# EasyEDA Pro project Motor_Driver_T.eprj

# Schematic Schematic1
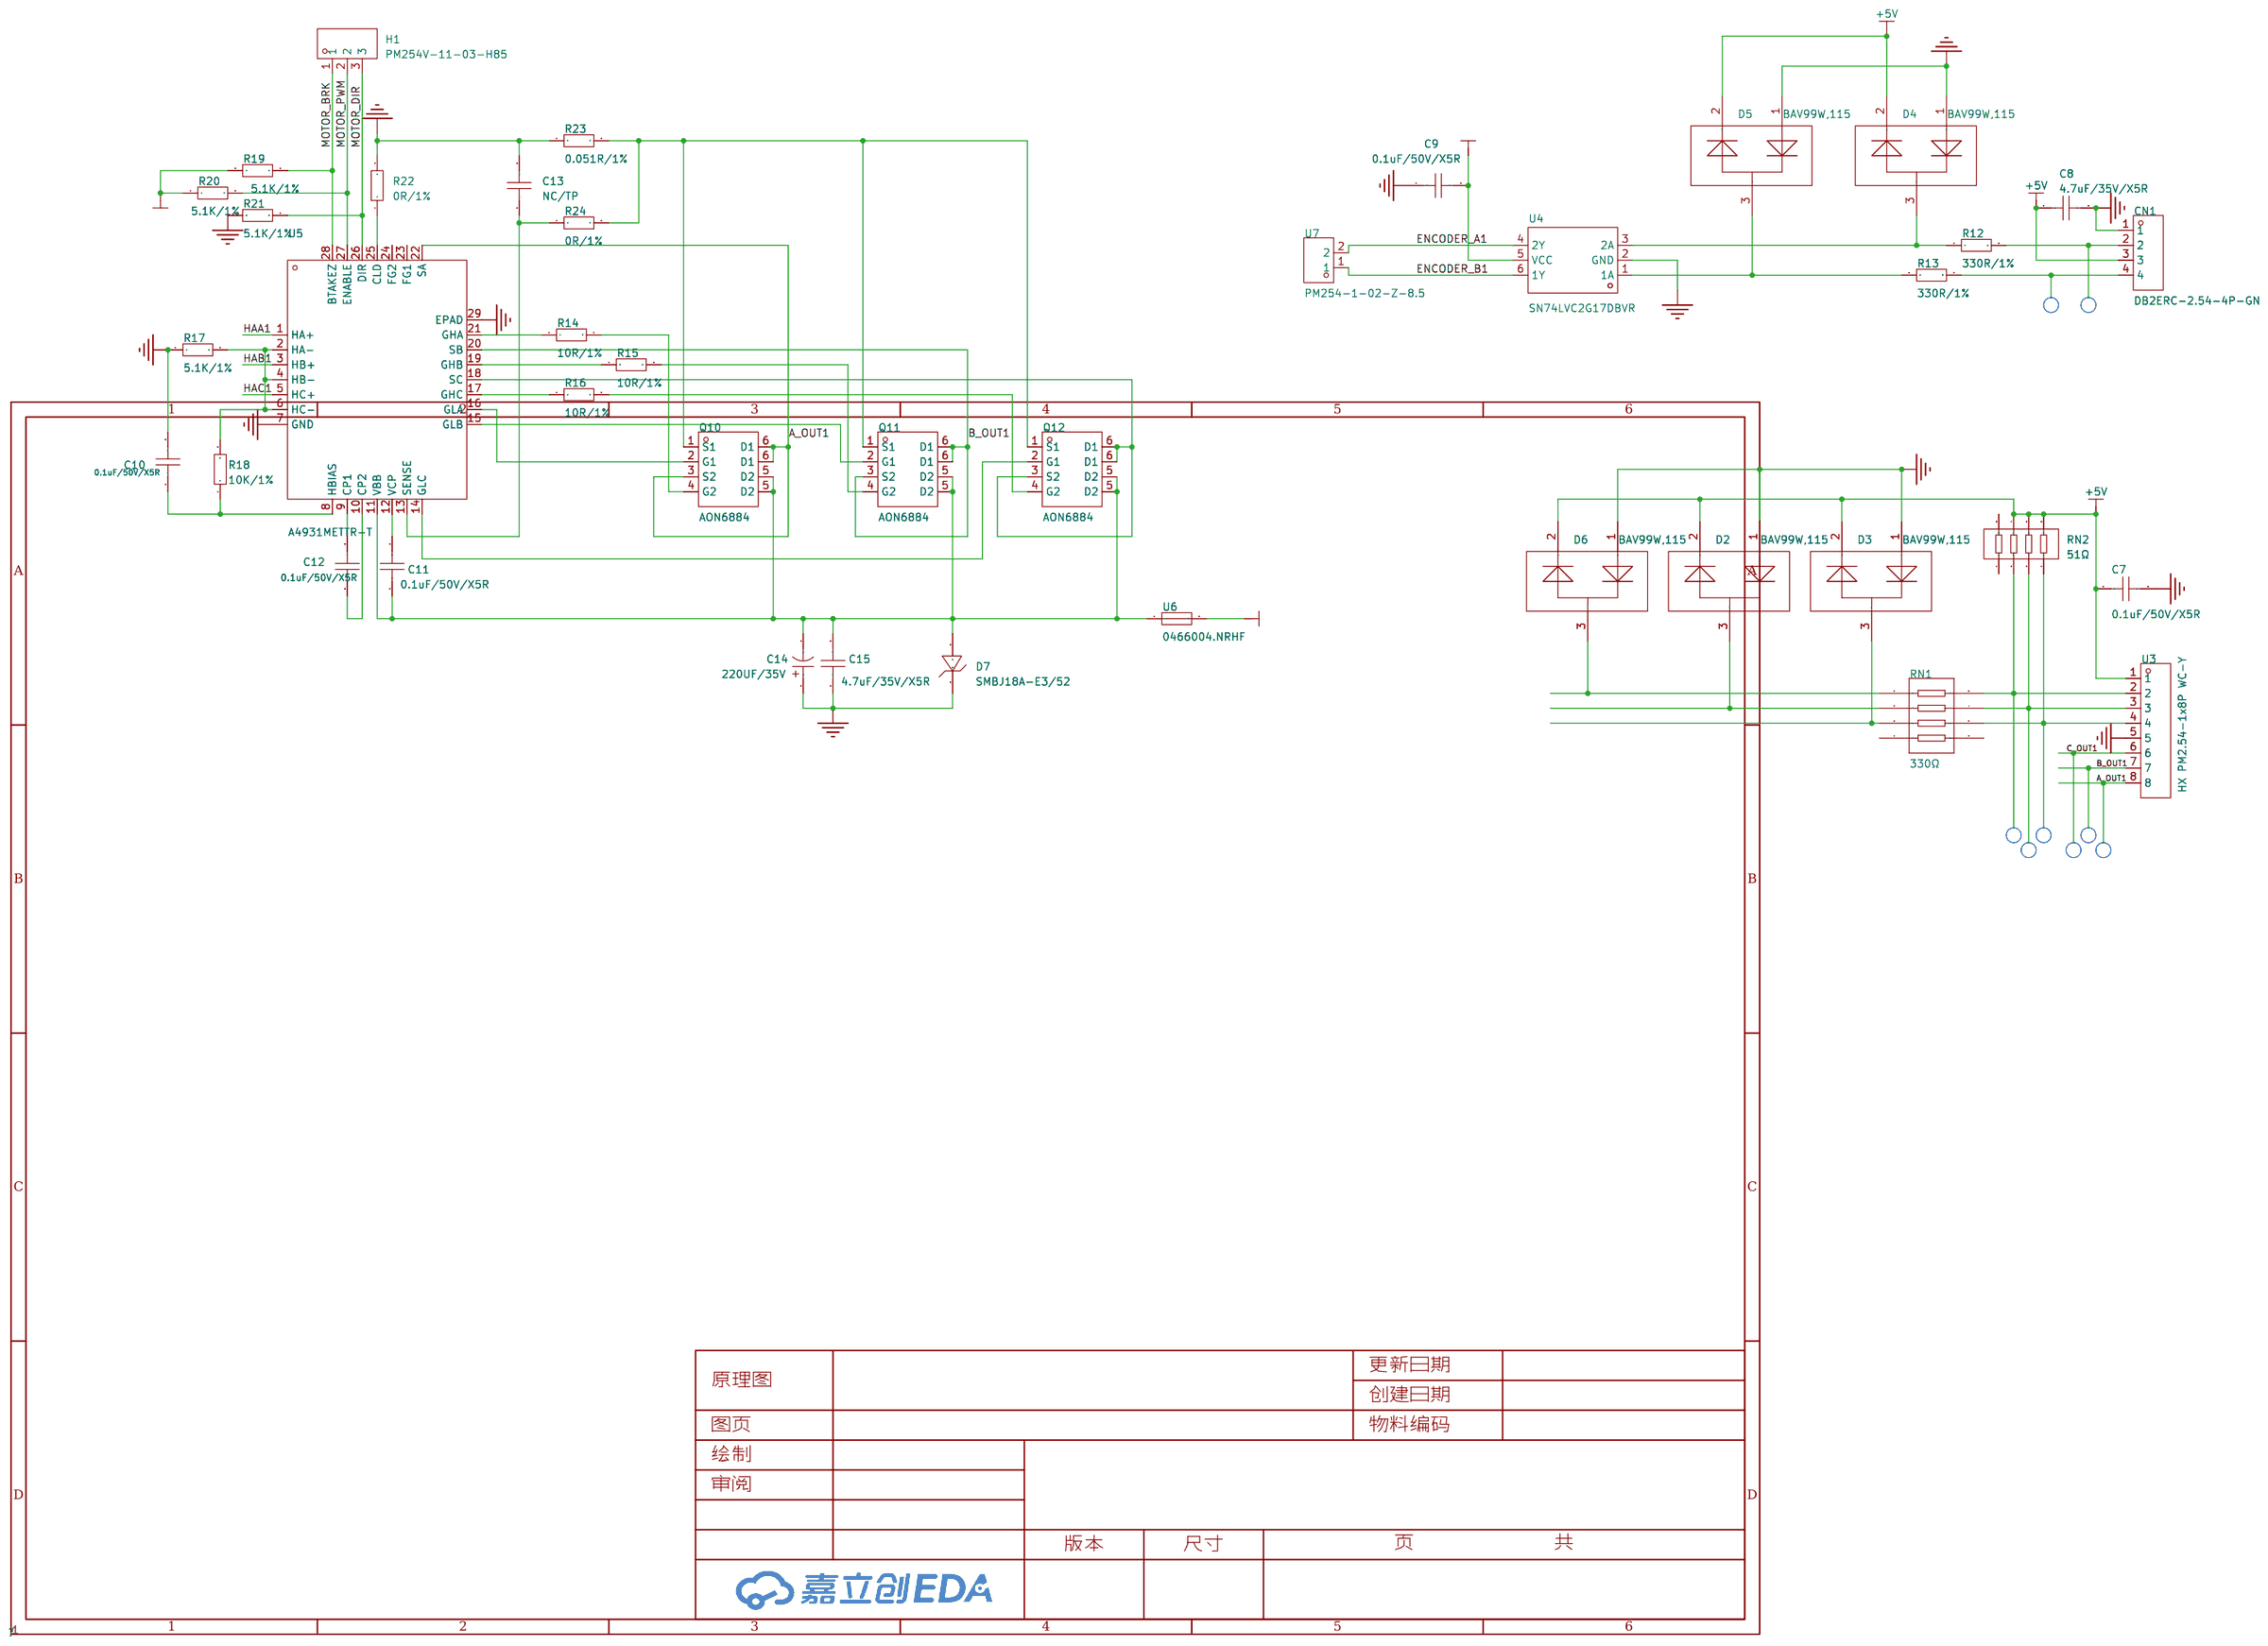
[diagram p0: schematic sheet]

## Parts
C7  100nF  [C0603]
C8  100nF  [C0603]
C9  100nF  [C0603]
C10  100nF  [C0603]
C11  100nF  [C0603]
C12  100nF  [C0603]
C13  100nF  [C0603]
C14  220uF  [CAP-SMD_BD8.0-L8.3-W8.3-LS9.3-FD]
C15  100nF  [C0603]
CN1  DB2ERC-2.54-4P-GN  [CONN-TH_4P-P2.54_DIBO_DB2ERC-2.54-4P-GN]
D2  BAV99W,115  [SOT-323_L2.0-W1.3-P1.30-LS2.1-BR]
D3  BAV99W,115  [SOT-323_L2.0-W1.3-P1.30-LS2.1-BR]
D4  BAV99W,115  [SOT-323_L2.0-W1.3-P1.30-LS2.1-BR]
D5  BAV99W,115  [SOT-323_L2.0-W1.3-P1.30-LS2.1-BR]
D6  BAV99W,115  [SOT-323_L2.0-W1.3-P1.30-LS2.1-BR]
D7  SMBJ18A-E3/52  [SMB_L4.6-W3.6-LS5.4-RD]
H1  PM254V-11-03-H85  [HDR-TH_3P-P2.54-V-F]
Q10  AON6884  [DFN-8_L5.5-W5.2-P1.27-LS6.0-BL-EP2]
Q11  AON6884  [DFN-8_L5.5-W5.2-P1.27-LS6.0-BL-EP2]
Q12  AON6884  [DFN-8_L5.5-W5.2-P1.27-LS6.0-BL-EP2]
R12  10K  [R0603]
R13  10K  [R0603]
R14  10K  [R0603]
R15  10K  [R0603]
R16  10K  [R0603]
R17  10K  [R0603]
R18  10K  [R0603]
R19  10K  [R0603]
R20  10K  [R0603]
R21  10K  [R0603]
R22  10K  [R0603]
R23  10K  [R0603]
R24  10K  [R0603]
RN1  330Ω  [RES-ARRAY-SMD_0603-8P-L3.2-W1.6-BL]
RN2  51Ω  [RES-ARRAY-SMD_8P-L3.2-W1.6-P0.80-BL-1]
U3  HX PM2.54-1x8P WC-Y  [HDR-TH_8P-P2.54-H-F-W10.3-N]
U4  SN74LVC2G17DBVR  [SOT-23-6_L2.9-W1.6-P0.95-LS2.8-BL]
U5  A4931METTR-T  [WQFN-28_L5.0-W5.0-P0.50-BL-EP3.2]
U6  0466004.NRHF  [F1206]
U7  PM254-1-02-Z-8.5  [HDR-TH_2P-P2.54-V-F]

## Library data of the parts
C7-C13 C15 = CAP_0603: Supplier Footprint: 0603
C14 = RVT220UF35V67RV0024: 容值:220uF;精度:±20%;额定电压:35V;纹波电流:195mA@120Hz;等效串联电阻:-;; LCSC Part Name: 220uF ±20% 35V; Supplier Part: C2836441; Manufacturer: KNSCHA(科尼盛); Supplier Footprint: SMD,D8xL10.2mm; JLCPCB Part Class: 扩展库; Datasheet: https://atta.szlcsc.com/upload/public/pdf/source/20210528/C2836441_17B1F737CDEB8BC64E6C288AF923F1CC.pdf; Supplier: LCSC; Tolerance: ±20%; Rated Voltage: 35V; Ripple Current: 195mA@120Hz; φD: 8mm; L: 10.2mm; Lifetime @ Temp: 2000hrs@105℃; Operating Temperature: -55℃~+105℃
CN1 = DB2ERC-2.54-4P-GN: 连接器类型:板端/插座-闭口;结构:1x4P;间距:2.54mm;颜色:绿色;安装方式:弯针;排数:1;每排PIN数:4;额定电流:5A;额定电压:150V;触头材质:铜合金;触头镀层:锡;工作温度范围:-40℃~+105℃;; LCSC Part Name: 2.54mm 1x4P 排数:1 每排P数:4; Supplier Part: C2927505; Manufacturer: DORABO(地博电气); Supplier Footprint: 弯插,P=2.54mm; JLCPCB Part Class: 扩展库; Datasheet: https://atta.szlcsc.com/upload/public/pdf/source/20230321/910C409D9BDC2B7494BE314CD29A7494.pdf; Supplier: LCSC; Connector Type: 板端/插座-闭口; Structure: 1x4P; Pitch: 2.54mm; Color: 绿色; Mounting Style: 弯针; Number of Pins: 4P; Number of Rows: 1; Number of PINs Per Row: 4; Current Rating (Max): 5A; Voltage Rating (Max): 150V; Contact Material: 铜合金; Contact Plating: 锡; Operating Temperature Range: -40℃~+105℃
D2-D6 = BAV99W,115: 二极管配置:1对串联式;正向压降(Vf):1.25V@150mA;直流反向耐压(Vr):100V;平均整流电流(Io):150mA;功率:200mW;反向恢复时间(trr):4ns;; LCSC Part Name: 电压:100V 电流:150mA; Supplier Part: C8662; Manufacturer: Nexperia(安世); Supplier Footprint: SOT-323-3; JLCPCB Part Class: Extended Part; Datasheet: https://atta.szlcsc.com/upload/public/pdf/source/20151007/1457707429518.pdf; Supplier: LCSC; Diode Configuration: 1对串联式; Forward Voltage (Vf@If): 1.25V@150mA; Reverse Voltage (Vr): 100V; Average Rectified Current (Io): 150mA; Power Dissipation: 200mW; Reverse Leakage Current: 500nA@80V; Reverse Recovery Time (trr): 4ns
D7 = SMBJ18A-E3/52: 反向截止电压(Vrwm):18V;最大钳位电压:29.2V;峰值脉冲电流(Ipp)@10/1000us:20.5A;峰值脉冲功率(Ppp)@10/1000us:600W;击穿电压:20V;; Supplier Part: C435935; Manufacturer: VISHAY(威世); Supplier Footprint: SMB; JLCPCB Part Class: 扩展库; Datasheet: https://atta.szlcsc.com/upload/public/pdf/source/20191009/C435939_EC13D582B73C228060B5D2BC7D2C8C7F.pdf; Supplier: LCSC; Reverse Stand-Off Voltage (Vrwm): 18V; Maximum Clamping Voltage: 29.2V; Peak Pulse Current (Ipp)@10/1000us: 20.5A; Peak Pulse Power Dissipation (Ppp)@10/1000us: 600W; Breakdown Voltage: 20V; Type: TVS
H1 = PM254V-11-03-H85: LCSC Part Name: 间距:2.54mm 1x3P 直插; Supplier Part: C541850; Manufacturer: XFCN(兴飞); Supplier Footprint: 插件,P=2.54mm; JLCPCB Part Class: 扩展库; Datasheet: https://atta.szlcsc.com/upload/public/pdf/source/20200518/C541849_85853D71FC67C51915A806977A588FDA.pdf; Supplier: LCSC; Holes Structure: 1x3P; Pitch: 2.54mm; Mounting Type: 直插; Number of Rows: 单排; Number of Holes: 3P; Contact Material: 黄铜
Q10-Q12 = AON6884: 类型:2个N沟道;漏源电压(Vdss):40V;连续漏极电流(Id):9A;功率(Pd):1.6W;导通电阻(RDS(on)@Vgs,Id):11.3mΩ@10V,10A;阈值电压(Vgs(th)@Id):2.7V@250uA;; LCSC Part Name: 2个N沟道 耐压:40V 电流:9A; Supplier Part: C125872; Manufacturer: AOS; Supplier Footprint: DFN-8(5.2x5.5); JLCPCB Part Class: 扩展库; Datasheet: https://atta.szlcsc.com/upload/public/pdf/source/20180326/C125872_34AF0DD57D8DED273B86A053347F87CE.pdf; Supplier: LCSC; Type: 2个N沟道; Drain Source Voltage (Vdss): 40V; Continuous Drain Current (Id): 9A; Power Dissipation (Pd): 1.6W; Drain Source On Resistance (RDS(on)@Vgs,Id): 11.3mΩ@10V,10A; Gate Threshold Voltage (Vgs(th)@Id): 2.7V@250uA
R12-R24 = Res_0603: Supplier Footprint: 0603
RN1 = 4D03WGJ0331T5E: 电阻器数:4;阻值:330Ω;精度:±5%;单个元件功率:62.5mW;温度系数:±200ppm/℃;; LCSC Part Name: 330Ω ±5% 0603x4; Supplier Part: C12018; Manufacturer: UNI-ROYAL(厚声); Supplier Footprint: 0603x4; JLCPCB Part Class: 扩展库; Datasheet: https://atta.szlcsc.com/upload/public/pdf/source/20191224/C474318_2527498AE30E813171187CCD28401A71.pdf; Supplier: LCSC; Number of Resistors: 4; Tolerance: ±5%; Power(Watts): 62.5mW; Temperature Coefficient: ±200ppm/℃; Number of Pins: 8
RN2 = YC164-JR-0751RL: 电阻器数:4;阻值:51Ω;精度:±5%;单个元件功率:62.5mW;温度系数:±200ppm/℃;; LCSC Part Name: 51Ω ±5% 0603x4; Supplier Part: C13474; Manufacturer: YAGEO(国巨); Supplier Footprint: 0603x4; JLCPCB Part Class: 扩展库; Datasheet: https://atta.szlcsc.com/upload/public/pdf/source/20140324/1457707028693.pdf; Supplier: LCSC; Number of Resistors: 4; Tolerance: ±5%; Power(Watts): 62.5mW; Temperature Coefficient: ±200ppm/℃; Number of Pins: 8
U3 = HX PM2.54-1x8P WC-Y: 排母——插孔结构：1x8P 间距：2.54mm 行距：- 圆孔/方孔：方孔 安装类型：弯插 排数：单排 总孔位数：8P 额定电流：3A 额定电压：AC1000V 塑高：8.5mm 端接针长度：3.2mm 触头材质：磷青铜 触头镀层：金 工作温度范围：-40℃~+105℃ 焊接温度(最大值)：260℃ 颜色：黑色 6T材质环保阻燃UL认证 配套排针：HX PZ2.54-1x8P; LCSC Part Name: 间距：2.54mm 1*8P 弯插排母 Y型; Supplier Part: C22438149; Manufacturer: hanxia(韩下); Supplier Footprint: 弯插,P=2.54mm; Datasheet: https://atta.szlcsc.com/upload/public/pdf/source/20240522/50227E60AC0A6ED5E9995637E3595CAF.pdf; Supplier: LCSC
U4 = SN74LVC2G17DBVR: 输入类型:施密特触发器;电源电压:1.65V~5.5V;元件数:2;每个元件位数:1;灌电流(IOL):32mA;拉电流(IOH):32mA;; Supplier Part: C10429; Manufacturer: TI(德州仪器); Supplier Footprint: SOT-23-6; JLCPCB Part Class: 扩展库; Datasheet: https://www.ti.com/cn/lit/gpn/sn74lvc2g17; Supplier: LCSC; Input type: 施密特触发器; output type: 推挽; Supply Voltage: 1.65V~5.5V; Number of Elements: 2; Number of Bits per Element: 1; Sink Current: 32mA; Source Current: 32mA; Logic Family: 74LVC; Operating Temperature: -40℃~+125℃
U5 = A4931METTR-T: 微功率，超灵敏，霍尔开关; LCSC Part Name: 无刷直流BLDC电机驱动芯片 37.5V; Supplier Part: C89724; Manufacturer: ALLEGRO(美国埃戈罗); Supplier Footprint: WQFN-28-EP(5x5); JLCPCB Part Class: 扩展库; Datasheet: https://atta.szlcsc.com/upload/public/pdf/source/20180122/C89724_15166131725631291885.pdf; Supplier: LCSC
U6 = 0466004.NRHF: 类型:贴片式保险丝;额定电流:4A;额定电压 (AC):32V;额定电压 (DC):32V;分断能力:50A;; LCSC Part Name: 32V贴片式保险丝; Supplier Part: C187596; Manufacturer: Littelfuse(美国力特); Supplier Footprint: 1206; JLCPCB Part Class: 扩展库; Datasheet: https://atta.szlcsc.com/upload/public/pdf/source/20180717/C206988_5F0E1BFD05A279C65E5494FD60374951.pdf; Supplier: LCSC; Type: 贴片式保险丝; Current Rating: 4A; Voltage Rating  (AC): 32V; Voltage Rating (DC): 32V; Operating Temperature: -55℃~+90℃; Breaking Capacity: 50A
U7 = PM254-1-02-Z-8.5: LCSC Part Name: 1x2P 间距:2.54mm 直插; Supplier Part: C2897365; Manufacturer: HCTL(华灿天禄); Supplier Footprint: 插件,P=2.54mm; JLCPCB Part Class: 扩展库; Datasheet: https://atta.szlcsc.com/upload/public/pdf/source/20230609/534BE42964C679BDE98E061007C4ABD6.pdf; Supplier: LCSC; Holes Structure: 1x2P; Pitch: 2.54mm; Circular Hole / Square Hole: 方孔; Mounting Type: 直插; Number of Rows: 单排; Number of Holes: 2P; Current Rating (Max): 3A; Holes Direction: 顶部; Insulation Height: 8.5mm; Contact Material: 铜合金; Operating Temperature Range: -40℃~+105℃; Soldering Temperature(Max): 260℃@5S

## Nets
+3V3: C9.2 R19.1 R20.1 U4.5(VCC)
+5V: C7.1 C8.1 CN1.3 D2.2 D3.2 D4.2 D5.2 D6.2 RN2.5 RN2.6 RN2.7 U3.1
GND: C7.2 C8.2 C9.1 C10.2 C13.2 C14.1 C15.1 CN1.1 D2.1 D3.1 D4.1 D5.1 D6.1 D7.1(C) R17.1 R21.1 R22.2 R23.1 U3.5 U4.2(GND) U5.7(GND) U5.29(EPAD)
VBAT: U6.2
A_OUT1: Q10.3(S2) Q10.6(D1) U3.8 U5.22(SA)
B_OUT1: Q11.3(S2) Q11.6(D1) U3.7 U5.20(SB)
C_OUT1: U3.6
ENCODER_A1: U4.4(2Y) U7.2
ENCODER_B1: U4.6(1Y) U7.1
HAA1: U5.1(HA+)
HAB1: U5.3(HB+)
HAC1: U5.5(HC+)
MOTOR_BRK: H1.1 R19.2 U5.28(BTAKEZ)
MOTOR_DIR: H1.3 R21.2 U5.26(DIR)
MOTOR_PWM: H1.2 R20.2 U5.27(ENABLE)
$1N4365: D3.3 RN1.3
$1N4566: D2.3 RN1.2
$1N4569: D6.3 RN1.1
$1N4776: RN1.8 RN2.2 U3.2
$1N4782: RN1.7 RN2.3 U3.3
$1N4786: RN1.6 RN2.4 U3.4
$1N5413: CN1.2 R12.2
$1N5417: CN1.4 R13.2
$1N5523: D4.3 R12.1 U4.3(2A)
$1N5568: D5.3 R13.1 U4.1(1A)
Net-(C10-1): C10.1 R18.1 U5.8(HBIAS)
Net-(C11-1): C11.1 C14.2 C15.2 D7.2(A) Q10.5(D2) Q11.5(D2) Q12.5(D2) U5.11(VBB) U6.1
Net-(C11-2): C11.2 U5.12(VCP)
Net-(C12-1): C12.1 U5.9(CP1)
Net-(C12-2): C12.2 U5.10(CP2)
Net-(C13-1): C13.1 R24.1 U5.13(SENSE)
Net-(Q10-1): Q10.1(S1) Q11.1(S1) Q12.1(S1) R23.2 R24.2
Net-(Q10-2): Q10.2(G1) U5.16(GLA)
Net-(Q10-4): Q10.4(G2) R14.2
Net-(Q11-2): Q11.2(G1) U5.15(GLB)
Net-(Q11-4): Q11.4(G2) R15.2
Net-(Q12-2): Q12.2(G1) U5.14(GLC)
Net-(Q12-3): Q12.3(S2) Q12.6(D1) U5.18(SC)
Net-(Q12-4): Q12.4(G2) R16.2
Net-(R14-1): R14.1 U5.21(GHA)
Net-(R15-1): R15.1 U5.19(GHB)
Net-(R16-1): R16.1 U5.17(GHC)
Net-(R17-2): R17.2 R18.2 U5.2(HA-) U5.4(HB-) U5.6(HC-)
Net-(R22-1): R22.1 U5.25(CLD)

Not connected (* = marked no-connect by the designer): RN1 4 5; RN2 1 8; U5 23(FG1) 24(FG2)

# Board PCB1
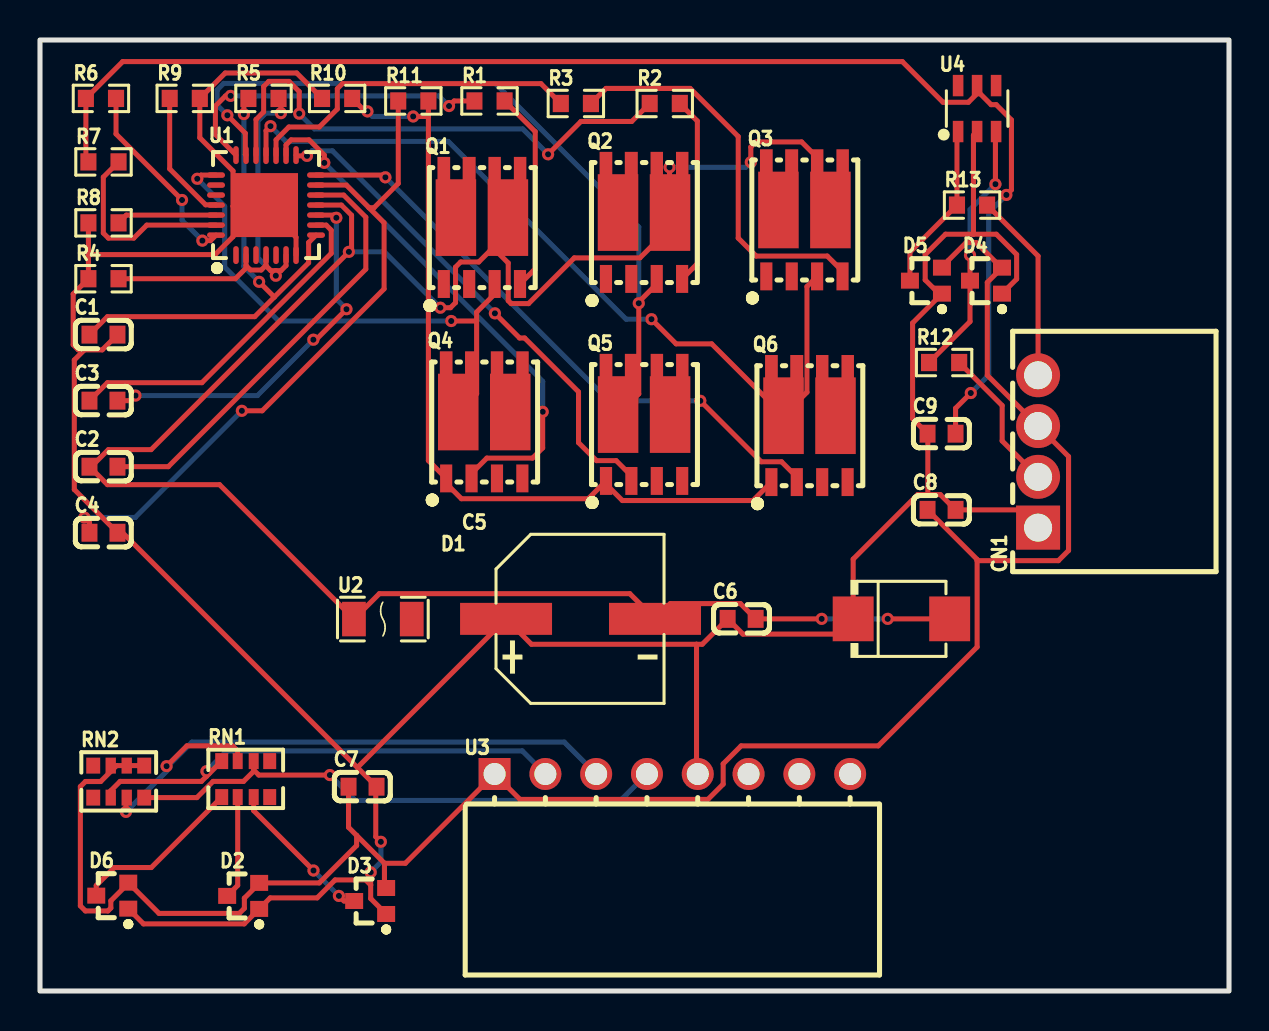
[diagram p1: board, top side]
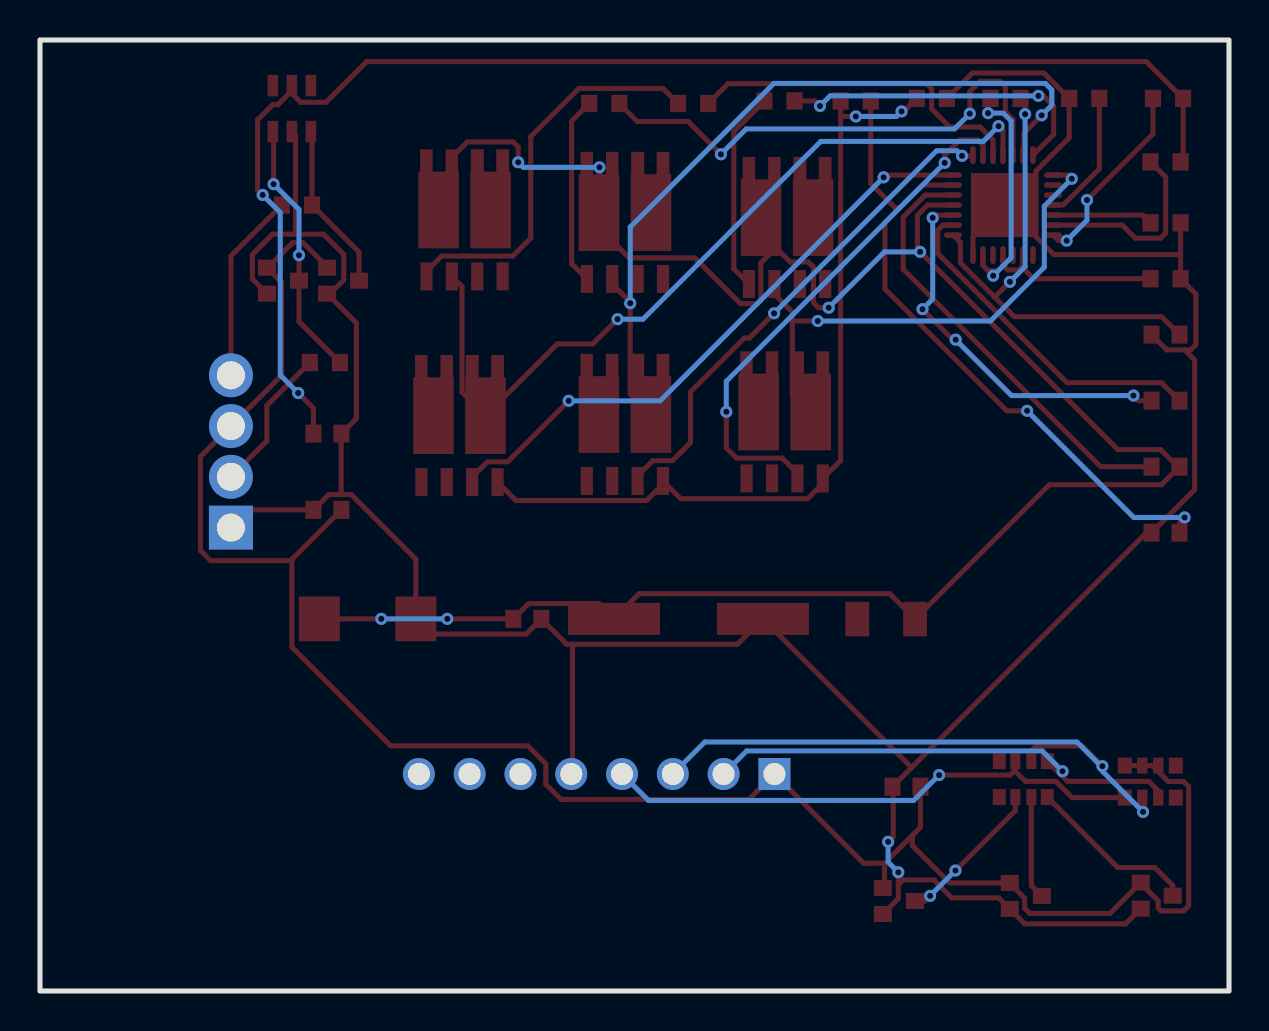
[diagram p2: board, bottom side, seen from below]

Outline 59.46 x 47.55 mm; copper layers: Top Layer, Bottom Layer. Coordinates in mm from the lower left corner of the outline.
Outline path: rectangle 0,47.55 59.46,0
Stack: Top Layer 0.035mm / Dielectric1 1.51mm FR4 er 4.5 / Bottom Layer 0.035mm

## Design rules (mm)
template: JLCPCB Capability(Two Layers Board)
spacing copperThickness1oz (default): track to track 0.102, other pairs 0.152 to 0.3
spacing copperThickness2oz: track to track 0.203, other pairs 0.152 to 0.3
track width copperThickness1oz (default): min 0.127, default 0.254, max 2.54
track width copperThickness2oz: min 0.203, default 0.254, max 2.54
differential pair differentialPair (default): width min 0.127, default 0.254, max 2.54; gap min 0.152, default 0.152
via viaSize (default): diameter min 0.5, default 0.61, max 10; hole min 0.3, default 0.305, max 6.3

## Placement (name value [footprint] x y rotation side)
C1  -  [C0603]  3.17 32.82 0 top
C2  -  [C0603]  3.17 26.22 0 top
C3  -  [C0603]  3.17 29.52 0 top
C4  -  [C0603]  3.17 22.92 0 top
C5  -  [CAP-SMD_BD8.0-L8.3-W8.3-LS9.3-FD]  27.03 18.61 0 top
C6  -  [C0603]  35.09 18.61 0 top
C7  100nF  [C0603]  16.13 10.22 0 top
C8  100nF  [C0603]  45.09 24.06 0 top
C9  100nF  [C0603]  45.09 27.87 0 top
CN1  DB2ERC-2.54-4P-GN  [CONN-TH_4P-P2.54_DIBO_DB2ERC-2.54-4P-GN]  49.91 26.98 90 top
D1  SMBJ18A-E3/52  [SMB_L4.6-W3.6-LS5.4-RD]  43.08 18.61 0 top
D2  BAV99W,115  [SOT-323_L2.0-W1.3-P1.30-LS2.1-BR]  10.16 4.75 0 top
D3  BAV99W,115  [SOT-323_L2.0-W1.3-P1.30-LS2.1-BR]  16.51 4.5 0 top
D4  BAV99W,115  [SOT-323_L2.0-W1.3-P1.30-LS2.1-BR]  47.31 35.52 0 top
D5  BAV99W,115  [SOT-323_L2.0-W1.3-P1.30-LS2.1-BR]  44.3 35.52 0 top
D6  BAV99W,115  [SOT-323_L2.0-W1.3-P1.30-LS2.1-BR]  3.61 4.77 0 top
Q1  AON6884  [DFN-8_L5.5-W5.2-P1.27-LS6.0-BL-EP2]  22.1 37.01 0 top
Q2  AON6884  [DFN-8_L5.5-W5.2-P1.27-LS6.0-BL-EP2]  30.21 37.27 0 top
Q3  AON6884  [DFN-8_L5.5-W5.2-P1.27-LS6.0-BL-EP2]  38.23 37.39 0 top
Q4  AON6884  [DFN-8_L5.5-W5.2-P1.27-LS6.0-BL-EP2]  22.22 27.29 0 top
Q5  AON6884  [DFN-8_L5.5-W5.2-P1.27-LS6.0-BL-EP2]  30.21 27.16 0 top
Q6  AON6884  [DFN-8_L5.5-W5.2-P1.27-LS6.0-BL-EP2]  38.48 27.11 0 top
R1  -  [R0603]  22.48 44.51 0 top
R2  -  [R0603]  31.24 44.38 0 top
R3  -  [R0603]  26.8 44.38 0 top
R4  -  [R0603]  3.17 35.62 0 top
R5  -  [R0603]  11.18 44.63 0 top
R6  -  [R0603]  3.05 44.63 0 top
R7  -  [R0603]  3.17 41.46 0 top
R8  -  [R0603]  3.17 38.41 0 top
R9  -  [R0603]  7.24 44.63 0 top
R10  -  [R0603]  14.86 44.63 0 top
R11  -  [R0603]  18.67 44.51 0 top
R12  10K  [R0603]  45.21 31.42 0 top
R13  10K  [R0603]  46.61 39.3 0 top
RN1  330Ω  [RES-ARRAY-SMD_0603-8P-L3.2-W1.6-BL]  10.29 10.6 0 top
RN2  51Ω  [RES-ARRAY-SMD_8P-L3.2-W1.6-P0.80-BL-1]  3.94 10.47 0 top
U1  A4931METTR-T  [WQFN-28_L5.0-W5.0-P0.50-BL-EP3.2]  11.3 39.3 0 top
U2  0466004.NRHF  [F1206]  17.15 18.6 0 top
U3  HX PM2.54-1x8P WC-Y  [HDR-TH_8P-P2.54-H-F-W10.3-N]  31.62 10.85 0 top
U4  SN74LVC2G17DBVR  [SOT-23-6_L2.9-W1.6-P0.95-LS2.8-BL]  46.86 44.12 0 top

## Footprints (pads in the part's own frame, mm; a bottom-side part is the same pattern mirrored in y, then rotated)
C0603
  rect 0.8x0.9 smd: 1(-0.7,0) 2(0.7,0)
CAP-SMD_BD8.0-L8.3-W8.3-LS9.3-FD
  rect 4.6x1.6 smd: 1(-3.724,0) 2(3.724,0)
CONN-TH_4P-P2.54_DIBO_DB2ERC-2.54-4P-GN
  rect 2.2x2.2 hole 1.4: 1(-3.81,0)
  round 2.2 hole 1.4: 2(-1.27,0) 3(1.27,0) 4(3.81,0)
DFN-8_L5.5-W5.2-P1.27-LS6.0-BL-EP2
  rect 0.61x1.397 smd: 1(-1.905,-1.66) 2(-0.635,-1.66) 3(0.635,-1.66) 4(1.905,-1.66)
  custom 2.028x4.953 smd: 5(1.3,1.66) 6(-1.3,1.66)
F1206
  rect 1.19x1.728 smd: 1(-1.445,0) 2(1.445,0)
HDR-TH_8P-P2.54-H-F-W10.3-N
  rect 1.6x1.6 hole 1.1: 1(-8.89,0)
  round 1.6 hole 1.1: 2(-6.35,0) 3(-3.81,0) 4(-1.27,0) 5(1.27,0) 6(3.81,0) 7(6.35,0) 8(8.89,0)
R0603
  rect 0.806x0.864 smd: 1(-0.753,0) 2(0.753,0)
RES-ARRAY-SMD_8P-L3.2-W1.6-P0.80-BL-1
  rect 0.7x0.8 smd: 1(-1.275,-0.8) 4(1.275,-0.8) 5(1.275,0.8) 8(-1.275,0.8)
  rect 0.52x0.8 smd: 2(-0.4,-0.8) 3(0.4,-0.8) 6(0.4,0.8) 7(-0.4,0.8)
RES-ARRAY-SMD_0603-8P-L3.2-W1.6-BL
  rect 0.65x0.8 smd: 1(-1.2,-0.9) 4(1.2,-0.9) 5(1.2,0.9) 8(-1.2,0.9)
  rect 0.5x0.8 smd: 2(-0.4,-0.9) 3(0.4,-0.9) 6(0.4,0.9) 7(-0.4,0.9)
SMB_L4.6-W3.6-LS5.4-RD
  rect 2.047x2.241 smd: 1(-2.413,0) 2(2.413,0)
SOT-23-6_L2.9-W1.6-P0.95-LS2.8-BL
  rect 0.532x1.072 smd: 1(-0.95,-1.149) 2(0,-1.149) 3(0.95,-1.149) 4(0.95,1.149) 5(0,1.149) 6(-0.95,1.149)
SOT-323_L2.0-W1.3-P1.30-LS2.1-BR
  rect 0.9x0.8 smd: 1(0.8,-0.65) 2(0.8,0.65) 3(-0.8,0)
WQFN-28_L5.0-W5.0-P0.50-BL-EP3.2
  oval 0.28x0.9 smd: 1(-1.502,-2.5) 2(-1.001,-2.5) 3(-0.5,-2.5) 4(0,-2.5) 5(0.5,-2.5) 6(1,-2.5) 7(1.501,-2.5) 15(1.501,2.5) 16(1,2.5) 17(0.5,2.5) 18(0,2.5) 19(-0.5,2.5) 20(-1.001,2.5) 21(-1.502,2.5)
  oval 0.9x0.28 smd: 8(2.5,-1.502) 9(2.5,-1.001) 10(2.5,-0.5) 11(2.5,0) 12(2.5,0.5) 13(2.5,1) 14(2.5,1.501) 22(-2.5,1.501) 23(-2.5,1) 24(-2.5,0.5) 25(-2.5,0) 26(-2.5,-0.5) 27(-2.5,-1.001) 28(-2.5,-1.502)
  rect 3.2x3.2 smd: 29(0,0)

## Nets
+3V3: C9.2 R6.1 R7.1 U4.5
+5V: C7.1 C8.1 CN1.3 D2.2 D3.2 D4.2 D5.2 D6.2 RN2.5 RN2.6 RN2.7 U3.1
GND: C1.2 C4.2 C5.1 C6.1 C7.2 C8.2 C9.1 CN1.1 D1.1 D2.1 D3.1 D4.1 D5.1 D6.1 R4.1 R8.1 R9.2 R10.1 U1.7 U1.29 U3.5 U4.2
VBAT: U2.2
A_OUT1: U3.8
B_OUT1: U3.7
C_OUT1: U3.6
HAA1: U1.1
HAB1: U1.3
HAC1: U1.5
MOTOR_BRK: R6.2 U1.28
MOTOR_DIR: R8.2 U1.26
MOTOR_PWM: R7.2 U1.27
$1N482: R2.1 U1.19
$1N873: Q1.4 R1.2
$1N884: Q4.2 U1.16
$1N943: Q5.2 U1.15
$1N952: Q6.2 U1.14
$1N1026: Q3.3 Q6.6 U1.18
$1N1535: R4.2 R5.2 U1.2 U1.4 U1.6
$1N1681: C1.1 R5.1 U1.8
$1N2471: C2.2 U1.12
$1N2763: Q2.4 R2.2
$1N2785: Q1.3 Q4.6 U1.22
$1N2829: Q3.4 R3.2
$1N2834: Q2.3 Q5.6 U1.20
$1N2898: C2.1 C5.2 C6.2 D1.2 Q1.5 Q2.5 Q3.5 U1.11 U2.1
$1N2936: C3.2 U1.10
$1N2988: C3.1 U1.9
$1N3023: R9.1 U1.25
$1N3207: R1.1 U1.21
$1N3211: C4.1 R11.1 U1.13
$1N3214: R3.1 U1.17
$1N3334: Q4.1 Q5.1 Q6.1 R10.2 R11.2
$1N4365: D3.3 RN1.3
$1N4566: D2.3 RN1.2
$1N4569: D6.3 RN1.1
$1N4776: RN1.8 RN2.2 U3.2
$1N4782: RN1.7 RN2.3 U3.3
$1N4786: RN1.6 RN2.4 U3.4
$1N5413: CN1.2 R12.2
$1N5417: CN1.4 R13.2
$1N5523: D4.3 R12.1 U4.3
$1N5568: D5.3 R13.1 U4.1
$1N5953: U4.4
$1N5957: U4.6

Pads without a net: Q1 1 2 6; Q2 1 2 6; Q3 1 2 6; Q4 3 4 5; Q5 3 4 5; Q6 3 4 5; RN1 4 5; RN2 1 8; U1 23 24

## Via types
v1: diameter 0.61, hole 0.305, Top Layer to Bottom Layer, 48 vias

## Routing (per net, layer and track width the routed paths; a pad name or vN(x,y) marks a point on that pad's centre or on a via; arc(x,y) is an arc through that point)
+3V3: length 69.1
  Top Layer w0.254: 46.93,44.95 46.43,44.44 45.16,44.44 43.12,46.47 4.13,46.47 R6.1 2.29,41.59 R7.1 ; 46.93,44.95 47.56,44.32 47.82,44.32 48.58,43.56 48.58,40.06 v1(48.32,39.81) ; 46.93,44.95 46.86,45.02 U4.5 ; v1(46.55,29.9) 45.78,29.14 C9.2
  Bottom Layer w0.254: v1(48.32,39.81) 47.44,38.93 47.44,30.8 v1(46.55,29.9)
+5V: length 102
  Top Layer w0.254: 10.98,5.41 10.22,4.64 10.22,4.14 9.97,3.88 5.95,3.88 4.56,5.27 ; 10.98,5.41 13.97,5.41 15.83,7.27 15.83,7.78 ; 10.98,5.41 D2.2 ; 4.56,5.27 4.31,5.27 3.54,4.51 3.54,4.15 3.4,4 2.27,4 2.02,4.26 2.02,10.22 2.27,10.48 3.03,10.48 3.57,11.02 ; 4.56,5.27 D6.2 ; 15.83,7.78 17.22,6.39 ; 15.83,7.78 15.43,8.18 C7.1 ; 17.22,6.39 18.27,6.39 U3.1 24,9.58 33.4,9.58 34.16,10.34 34.16,11.36 35.06,12.26 41.92,12.26 46.86,17.2 46.86,21.52 ; 17.22,6.39 17.22,5.24 17.31,5.15 ; 48.09,36.15 47.37,35.43 47.37,30.79 CN1.3 51.44,26.73 51.44,22.03 50.93,21.52 46.86,21.52 ; 48.09,36.15 46.82,37.42 46.31,37.42 45.41,36.52 45.41,36.48 D5.2 ; 48.09,36.15 D4.2 ; 46.86,21.52 46.86,21.58 44.38,24.06 ; 3.57,11.02 3.83,11.27 RN2.6 RN2.5 ; 3.57,11.02 RN2.7
GND: length 161.7
  Top Layer w0.252: U1.7 12.8,37.69 11.25,39.24
  Top Layer w0.254: R10.1 12.84,45.9 9.26,45.9 R9.2 7.99,42.66 9.65,41 9.65,39.24 ; 9.65,39.24 9.65,37.72 8.75,36.82 2.42,36.82 ; 9.65,39.24 11.25,39.24 U1.29 ; 15.89,11.15 16.79,10.25 ; 15.89,11.15 4.13,22.92 C4.2 1.72,25.08 1.72,31.55 2.22,32.06 ; 15.89,11.15 15.89,11.2 C5.1 24.58,17.34 32.83,17.34 ; 16.79,10.25 16.79,7.71 v1(17.04,7.46) ; 16.79,10.25 C7.2 ; D4.1 48.84,35.6 48.84,36.83 47.82,37.84 46.68,37.84 ; 32.83,17.34 33.12,17.34 C6.1 35.15,17.85 39.9,17.85 D1.1 40.66,21.59 43.89,24.82 44.4,24.82 ; 32.83,17.34 32.83,10.91 U3.5 ; CN1.1 49.02,24.06 C8.2 45.02,24.82 44.4,24.82 ; 2.42,36.82 R4.1 1.66,34.85 1.66,32.31 1.91,32.06 2.22,32.06 ; 2.42,36.82 R8.1 ; 16.54,5.3 16.28,5.56 14.76,5.56 13.86,4.66 11.51,4.66 10.21,3.36 5.18,3.36 D6.1 ; 16.54,5.3 16.54,4.62 D3.1 ; 16.54,5.3 v1(16.54,5.94) ; 44.4,24.82 44.4,27.86 43.64,28.62 43.64,33.4 45.03,34.79 ; U4.2 46.68,42.79 46.68,37.84 ; 46.68,37.84 45.28,37.84 44.27,36.83 44.27,35.56 45.03,34.79 ; 45.03,34.79 D5.1 ; 2.22,32.06 3.11,32.06 C1.2
  Bottom Layer w0.254: v1(16.54,5.94) 17.04,6.44 v1(17.04,7.46)
MOTOR_BRK: length 9.7
  Top Layer w0.252: R6.2 3.8,42.86 v1(7.1,39.55) ; v1(8.12,37.52) 8.53,37.52 U1.28
  Bottom Layer w0.252: v1(7.1,39.55) 7.1,38.54 v1(8.12,37.52)
MOTOR_DIR: length 5
  Top Layer w0.252: R8.2 4.32,38.8 U1.26
MOTOR_PWM: length 9.9
  Top Layer w0.252: R7.2 3.17,40.7 3.17,37.9 3.42,37.65 4.69,37.65 5.34,38.3 U1.27
$1N482: length 26.2
  Top Layer w0.252: v1(12.96,43.87) 12.96,44.98 12.45,45.48 11.44,45.48 11.18,45.23 11.18,43.96 10.8,43.58 U1.19 ; v1(25.41,41.84) 27.05,43.48 29.59,43.48 R2.1
  Bottom Layer w0.252: v1(25.41,41.84) 24.14,43.11 13.72,43.11 v1(12.96,43.87)
$1N873: length 10.1
  Top Layer w0.254: Q1.4 24.76,36.12 24.76,42.97 R1.2
$1N884: length 26.3
  Top Layer w0.252: v1(25.14,28.96) 25.14,27.16 24.63,26.65 22.34,26.65 21.58,25.89 Q4.2 ; U1.16 12.3,42.31 12.56,42.56 13.45,42.56 14.22,41.8 v1(14.22,41.41)
  Bottom Layer w0.252: v1(25.14,28.96) 25.14,30.49 v1(14.22,41.41)
$1N943: length 25.4
  Top Layer w0.252: Q5.2 29.57,25.76 28.81,26.52 27.83,26.52 26.93,27.42 26.93,29.96 24.24,32.65 23.98,32.65 v1(22.75,33.89) ; v1(13.35,41.76) 12.84,41.76 U1.15
  Bottom Layer w0.252: v1(22.75,33.89) 14.62,42.01 13.6,42.01 v1(13.35,41.76)
$1N952: length 30.6
  Top Layer w0.252: v1(17.27,40.69) 17.16,40.8 U1.14 ; Q6.2 37.85,25.7 37.08,26.46 36.07,26.46 v1(33.02,29.51)
  Bottom Layer w0.252: v1(17.27,40.69) 28.45,29.51 v1(33.02,29.51)
$1N1026: length 40.9
  Top Layer w0.252: v1(30.58,33.59) 31.81,32.36 33.59,32.36 Q6.6 ; v1(11.53,43.25) 11.3,43.02 U1.18
  Top Layer w0.254: Q3.3 38.35,35.23 38.35,29.94 Q6.6
  Bottom Layer w0.252: v1(11.53,43.25) 12.29,42.48 20.42,42.48 29.31,33.59 v1(30.58,33.59)
$1N1535: length 21.2
  Top Layer w0.252: R5.2 12.05,44.52 v1(12.05,43.89) ; 11.79,36.02 12.05,36.02 12.3,36.28 U1.6 ; 11.79,36.02 11.54,36.02 11.29,36.28 ; 11.79,36.02 v1(11.79,35.77) ; 11.29,36.28 11.3,36.29 U1.4 ; 11.29,36.28 11.06,36.05 10.52,36.05 10.3,36.27 ; 10.3,36.27 U1.2 ; 10.3,36.27 10.3,36.15 9.77,35.62 R4.2
  Bottom Layer w0.252: v1(11.79,35.77) 10.9,36.67 10.9,43.5 11.28,43.89 v1(12.05,43.89)
$1N1681: length 24.6
  Top Layer w0.252: U1.8 13.43,37.43 13.43,36.41 11.72,34.7 ; 11.72,34.7 v1(10.96,35.46) ; 11.72,34.7 10.74,33.72 3.37,33.72 C1.1 ; v1(10.19,43.84) 10.19,44.41 R5.1
  Bottom Layer w0.252: v1(10.19,43.84) 10.19,36.22 v1(10.96,35.46)
$1N2471: length 22.1
  Top Layer w0.252: U1.12 15.19,39.8 16.29,38.69 16.29,36.1 6.42,26.22 C2.2
$1N2763: length 9.5
  Top Layer w0.254: Q2.4 32.87,36.37 32.87,43.5 R2.2
$1N2785: length 26.9
  Top Layer w0.252: U1.22 8.05,40.8 v1(7.86,40.61) ; 21.84,33.5 v1(20.56,33.5)
  Top Layer w0.254: Q1.3 22.73,34.84 21.84,33.95 21.84,29.87 Q4.6
  Bottom Layer w0.252: v1(20.56,33.5) 11.93,33.5 9.24,36.2 9.24,39.24 v1(7.86,40.61)
$1N2829: length 19.9
  Top Layer w0.254: Q3.4 40.13,35.99 39.37,36.75 35.81,36.75 34.92,37.65 34.92,42.73 32.51,45.13 28.3,45.13 R3.2
$1N2834: length 39.4
  Top Layer w0.252: U1.20 10.27,41.83 10.27,42.89 v1(9.37,43.79)
  Top Layer w0.254: Q5.6 29.94,29.86 29.94,34.45 30.84,35.35 Q2.3
  Bottom Layer w0.252: v1(29.94,34.39) 29.94,38.2 22.76,45.39 9.19,45.39 8.86,45.06 8.86,44.3 v1(9.37,43.79)
$1N2898: length 108.9
  Top Layer w0.252: U1.11 15.07,39.3 15.58,38.79 15.58,37.09 5.56,27.07 3.42,27.07 2.52,26.17 ; Q1.5 22.84,38.11 22.84,37.35 21.94,36.45 21.03,36.45 20.78,36.2 20.78,34.42 20.53,34.17 v1(20.02,34.17)
  Top Layer w0.254: 22.65,37.17 23.41,36.4 23.41,34.52 23.56,34.37 24.43,34.37 26.72,36.66 30,36.66 30.9,37.56 30.9,38.32 31.48,38.9 ; Q3.5 38.98,39.6 38.98,41.56 38.09,42.46 35.8,42.46 35.55,42.2 v1(35.55,41.44) ; v1(42.39,18.61) D1.2 ; C2.1 3.37,25.32 8.98,25.32 U2.1 16.97,19.87 29.5,19.87 C5.2 31.52,19.37 35.03,19.37 C6.2 v1(39.09,18.61) ; 31.48,38.9 Q2.5 ; 31.48,38.9 v1(31.48,41.19)
  Bottom Layer w0.252: v1(15.45,36.96) 17.22,36.96 v1(20.02,34.17)
  Bottom Layer w0.254: v1(31.48,41.19) 35.29,41.19 v1(35.55,41.44) ; v1(39.09,18.61) v1(42.39,18.61)
$1N2936: length 19.2
  Top Layer w0.252: v1(14.82,38.66) 14.68,38.8 U1.10 ; v1(15.33,34.09) 13.8,32.57 v1(13.67,32.57) ; C3.2 4.52,29.52 v1(4.78,29.77)
  Bottom Layer w0.252: v1(13.67,32.57) 10.87,29.77 v1(4.78,29.77) ; v1(14.82,38.66) 14.82,34.6 v1(15.33,34.09)
$1N2988: length 17.2
  Top Layer w0.252: C3.1 3.37,30.42 8.1,30.42 14.56,36.89 14.56,38.04 14.31,38.3 U1.9
$1N3023: length 6.6
  Top Layer w0.252: U1.25 8.79,39.31 8.28,39.31 6.49,41.11 R9.1
$1N3207: length 16.4
  Top Layer w0.252: v1(20.46,44.25) 20.71,44.51 R1.1 ; v1(9.53,44.76) 9.28,44.76 8.77,44.25 8.77,42.83 U1.21
  Bottom Layer w0.252: v1(20.46,44.25) 19.95,44.76 v1(9.53,44.76)
$1N3211: length 34.2
  Top Layer w0.252: v1(2.22,23.68) 2.47,23.42 C4.1 ; R11.1 17.92,40.38 16.7,39.17 16.45,39.17 ; 16.45,39.17 17.21,38.41 17.21,35.11 11.11,29.01 v1(10.09,29.01) ; 16.45,39.17 15.32,40.3 U1.13
  Bottom Layer w0.252: v1(10.09,29.01) 4.76,23.68 v1(2.22,23.68)
$1N3214: length 17.2
  Top Layer w0.252: R3.1 25.05,45.37 15.12,45.37 14.87,45.12 14.87,44.1 13.97,43.2 12.45,43.2 11.8,42.56 U1.17
$1N3334: length 41.5
  Top Layer w0.254: Q6.1 35.66,24.53 29.12,24.53 28.22,25.42 ; 19.42,43.73 19.42,26.52 Q4.1 20.31,25.38 21.07,24.62 27.42,24.62 28.22,25.42 ; 19.42,43.73 R11.2 ; 19.42,43.73 v1(18.66,43.73) ; R10.2 16.26,43.98 v1(16.37,43.98) ; 28.22,25.42 Q5.1
  Bottom Layer w0.254: v1(18.66,43.73) 16.63,43.73 v1(16.37,43.98)
$1N4365: length 7.6
  Top Layer w0.254: D3.3 15.2,4.5 v1(14.95,4.75) ; RN1.3 10.69,9.02 v1(13.68,6.03)
  Bottom Layer w0.254: v1(14.95,4.75) v1(13.68,6.03)
$1N4566: length 5.2
  Top Layer w0.254: D2.3 9.89,5.28 RN1.2
$1N4569: length 8.6
  Top Layer w0.254: D6.3 2.81,5.28 3.71,6.17 5.56,6.17 9.09,9.7
$1N4776: length 24.6
  Top Layer w0.254: 9.09,11.5 8.32,10.73 ; 8.32,10.73 v1(8.32,10.99) ; 8.32,10.73 8.07,10.48 4.01,10.48 3.54,10.01 RN2.2
  Bottom Layer w0.254: v1(8.32,10.99) 9.34,12 24.12,12 U3.2
$1N4782: length 31.1
  Top Layer w0.254: RN2.3 4.3,9.63 v1(4.3,8.96) ; v1(6.33,11.24) 7.35,12.26 9.63,12.26 9.89,12 RN1.7
  Bottom Layer w0.254: U3.3 26.21,12.45 7.6,12.45 6.33,11.18 ; v1(6.33,11.24) 6.33,11.18 ; 6.33,11.18 6.33,10.99 v1(4.3,8.96)
$1N4786: length 27.4
  Top Layer w0.254: RN2.4 7.84,9.67 8.66,10.48 10.18,10.48 10.69,10.99 10.69,11.05 ; RN1.6 10.69,11.05 ; 10.69,11.05 10.94,10.8 v1(14.5,10.8)
  Bottom Layer w0.254: U3.4 29.03,9.53 15.77,9.53 v1(14.5,10.8)
$1N5413: length 7.3
  Top Layer w0.254: CN1.2 48.12,27.51 48.12,29.28 R12.2
$1N5417: length 9.6
  Top Layer w0.254: CN1.4 49.91,36.75 R13.2
$1N5523: length 12.9
  Top Layer w0.254: R12.1 46.51,33.47 D4.3 v1(46.51,36.79) ; v1(47.78,40.35) 47.78,42.94 U4.3
  Bottom Layer w0.254: v1(46.51,36.79) 46.51,39.08 v1(47.78,40.35)
$1N5568: length 8.5
  Top Layer w0.254: D5.3 43.5,36.95 R13.1 45.86,42.92 U4.1
